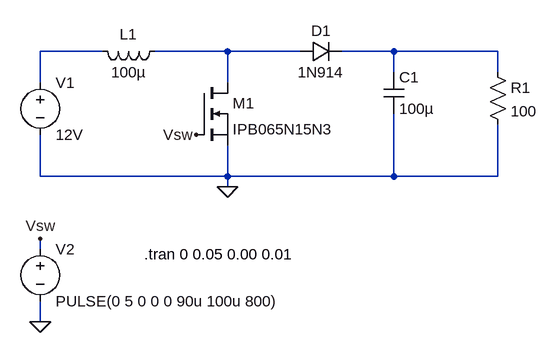
[diagram p0: schematic SelfBoost.asc]
SelfBoost.asc, the LTspice schematic file:
Version 4
SHEET 1 880 680
WIRE 64 144 -32 144
WIRE 256 144 144 144
WIRE 368 144 256 144
WIRE 512 144 432 144
WIRE 672 144 512 144
WIRE 512 176 512 144
WIRE 672 176 672 144
WIRE -32 192 -32 144
WIRE 256 192 256 144
WIRE -32 336 -32 272
WIRE 256 336 256 288
WIRE 256 336 -32 336
WIRE 512 336 512 240
WIRE 512 336 256 336
WIRE 672 336 672 256
WIRE 672 336 512 336
WIRE 256 352 256 336
WIRE -32 448 -32 432
WIRE -32 560 -32 528
FLAG 256 352 0
FLAG -32 560 0
FLAG -32 432 Vsw
FLAG 208 272 Vsw
SYMBOL ind 160 128 R90
WINDOW 0 5 56 VBottom 2
WINDOW 3 32 56 VTop 2
SYMATTR InstName L1
SYMATTR Value 100µ
SYMBOL diode 368 128 M90
WINDOW 0 0 32 VBottom 2
WINDOW 3 32 32 VTop 2
SYMATTR InstName D1
SYMATTR Value 1N914
SYMBOL cap 496 176 R0
SYMATTR InstName C1
SYMATTR Value 100µ
SYMBOL voltage -32 176 R0
WINDOW 123 0 0 Left 0
WINDOW 39 0 0 Left 0
SYMATTR InstName V1
SYMATTR Value 12V
SYMBOL voltage -32 432 R0
WINDOW 123 0 0 Left 0
WINDOW 39 0 0 Left 0
SYMATTR InstName V2
SYMATTR Value PULSE(0 5 0 0 0 90u 100u 800)
SYMBOL nmos 208 192 R0
SYMATTR InstName M1
SYMATTR Value IPB065N15N3
SYMBOL res 656 160 R0
SYMATTR InstName R1
SYMATTR Value 100
TEXT 128 456 Left 2 !.tran 0 0.05 0.00 0.01

The netlist it stands for:
* SelfBoost.asc
L1 N002 N001 100µ
D1 N002 N003 1N914
C1 N003 0 100µ
V1 N001 0 12V
V2 Vsw 0 PULSE(0 5 0 0 0 90u 100u 800)
M1 N002 Vsw 0 0 IPB065N15N3
R1 N003 0 100
.model D D
.lib standard.dio
.model NMOS NMOS
.model PMOS PMOS
.lib standard.mos
.tran 0 0.05 0.00 0.01
.backanno
.end